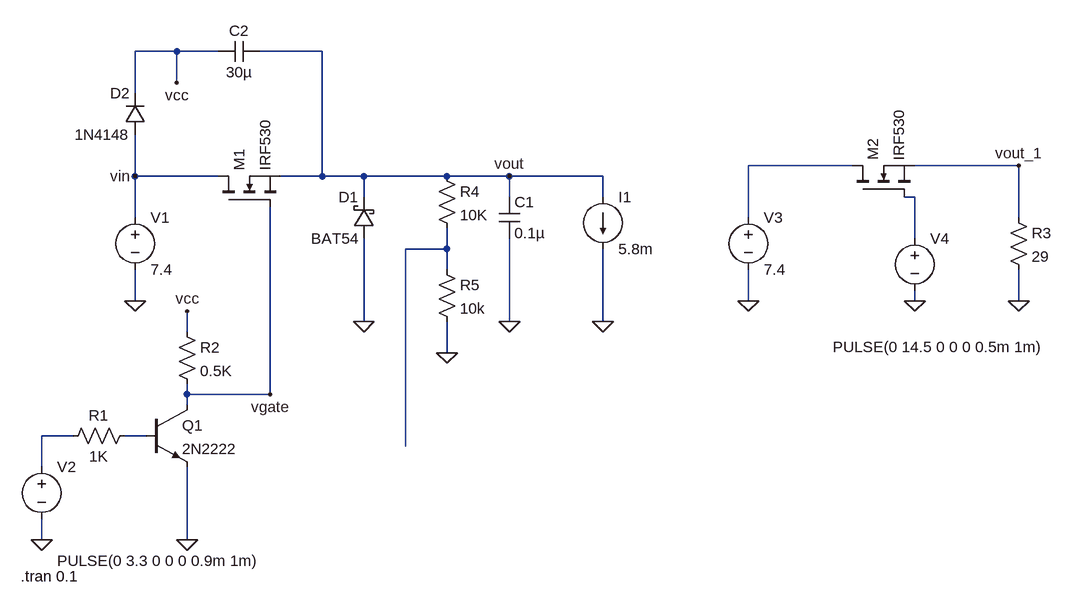
[diagram p0: schematic Chopper_for_drone.asc]
Chopper_for_drone.asc, the LTspice schematic file:
Version 4
SHEET 1 1640 760
WIRE 48 -64 -16 -64
WIRE 112 -64 48 -64
WIRE 272 -64 176 -64
WIRE 48 -16 48 -64
WIRE -16 0 -16 -64
WIRE 1088 112 928 112
WIRE 1344 112 1184 112
WIRE -16 128 -16 64
WIRE 112 128 -16 128
WIRE 272 128 272 -64
WIRE 272 128 208 128
WIRE 336 128 272 128
WIRE 464 128 336 128
WIRE 560 128 464 128
WIRE 704 128 560 128
WIRE 336 160 336 128
WIRE 560 160 560 128
WIRE 704 160 704 128
WIRE 1184 160 1168 160
WIRE -16 192 -16 128
WIRE 928 192 928 112
WIRE 1344 192 1344 112
WIRE 1184 224 1184 160
WIRE 464 240 464 208
WIRE 464 240 400 240
WIRE 464 272 464 240
WIRE -16 320 -16 272
WIRE 928 320 928 272
WIRE 1184 320 1184 304
WIRE 1344 320 1344 272
WIRE 336 352 336 224
WIRE 560 352 560 224
WIRE 704 352 704 240
WIRE 64 368 64 336
WIRE 464 400 464 352
WIRE 64 464 64 448
WIRE 192 464 192 176
WIRE 192 464 64 464
WIRE 64 480 64 464
WIRE -112 528 -160 528
WIRE 0 528 -32 528
WIRE 400 544 400 240
WIRE -160 576 -160 528
WIRE -160 688 -160 656
WIRE 64 688 64 576
FLAG -16 320 0
FLAG -160 688 0
FLAG 64 336 vcc
FLAG 48 -16 vcc
FLAG 928 320 0
FLAG 1184 320 0
FLAG 336 352 0
FLAG 560 352 0
FLAG 704 352 0
FLAG 1344 320 0
FLAG 1344 112 vout_1
FLAG 560 128 vout
FLAG 192 464 vgate
FLAG -16 128 vin
FLAG 64 688 0
FLAG 464 400 0
DATAFLAG 256 464 ""
DATAFLAG 192 464 ""
DATAFLAG 192 464 ""
DATAFLAG 192 464 ""
DATAFLAG 192 464 ""
DATAFLAG 192 464 ""
DATAFLAG 192 464 ""
SYMBOL nmos 112 176 R270
SYMATTR InstName M1
SYMATTR Value IRF530
SYMBOL voltage -16 176 R0
WINDOW 123 0 0 Left 0
WINDOW 39 0 0 Left 0
SYMATTR InstName V1
SYMATTR Value 7.4
SYMBOL npn 0 480 R0
SYMATTR InstName Q1
SYMATTR Value 2N2222
SYMBOL res -16 512 R90
WINDOW 0 0 56 VBottom 2
WINDOW 3 32 56 VTop 2
SYMATTR InstName R1
SYMATTR Value 1K
SYMBOL voltage -160 560 R0
WINDOW 3 24 160 Left 2
WINDOW 123 0 0 Left 0
WINDOW 39 0 0 Left 0
SYMATTR InstName V2
SYMATTR Value PULSE(0 3.3 0 0 0 0.9m 1m)
SYMBOL res 48 352 R0
SYMATTR InstName R2
SYMATTR Value 0.5K
SYMBOL cap 176 -80 R90
WINDOW 0 0 32 VBottom 2
WINDOW 3 32 32 VTop 2
SYMATTR InstName C2
SYMATTR Value 30µ
SYMBOL diode 0 64 R180
WINDOW 0 24 64 Left 2
WINDOW 3 24 0 Left 2
SYMATTR InstName D2
SYMATTR Value 1N4148
SYMBOL voltage 928 176 R0
WINDOW 123 0 0 Left 0
WINDOW 39 0 0 Left 0
SYMATTR InstName V3
SYMATTR Value 7.4
SYMBOL nmos 1088 160 R270
SYMATTR InstName M2
SYMATTR Value IRF530
SYMBOL voltage 1184 208 R0
WINDOW 3 -126 183 Left 2
WINDOW 123 0 0 Left 0
WINDOW 39 0 0 Left 0
SYMATTR InstName V4
SYMATTR Value PULSE(0 14.5 0 0 0 0.5m 1m)
SYMBOL schottky 352 224 R180
WINDOW 0 24 64 Left 2
WINDOW 3 24 0 Left 2
SYMATTR InstName D1
SYMATTR Value BAT54
SYMATTR Description Diode
SYMATTR Type diode
SYMBOL cap 544 160 R0
SYMATTR InstName C1
SYMATTR Value 0.1µ
SYMBOL current 704 160 R0
WINDOW 123 0 0 Left 0
WINDOW 39 0 0 Left 0
SYMATTR InstName I1
SYMATTR Value 5.8m
SYMBOL res 1328 176 R0
SYMATTR InstName R3
SYMATTR Value 29
SYMBOL res 448 112 R0
SYMATTR InstName R4
SYMATTR Value 10K
SYMBOL res 448 256 R0
SYMATTR InstName R5
SYMATTR Value 10k
TEXT -192 744 Left 2 !.tran 0.1

The netlist it stands for:
* Chopper_for_drone.asc
M1 vin vgate vout vout IRF530
V1 vin 0 7.4
Q1 vgate N005 0 0 2N2222
R1 N005 N004 1K
V2 N004 0 PULSE(0 3.3 0 0 0 0.9m 1m)
R2 vcc vgate 0.5K
C2 vout vcc 30µ
D2 vin vcc 1N4148
V3 N001 0 7.4
M2 N001 N002 vout_1 vout_1 IRF530
V4 N002 0 PULSE(0 14.5 0 0 0 0.5m 1m)
D1 0 vout BAT54
C1 vout 0 0.1µ
I1 vout 0 5.8m
R3 vout_1 0 29
R4 vout N003 10K
R5 N003 0 10k
.model D D
.lib standard.dio
.model NPN NPN
.model PNP PNP
.lib standard.bjt
.model NMOS NMOS
.model PMOS PMOS
.lib standard.mos
.tran 0.1
.backanno
.end